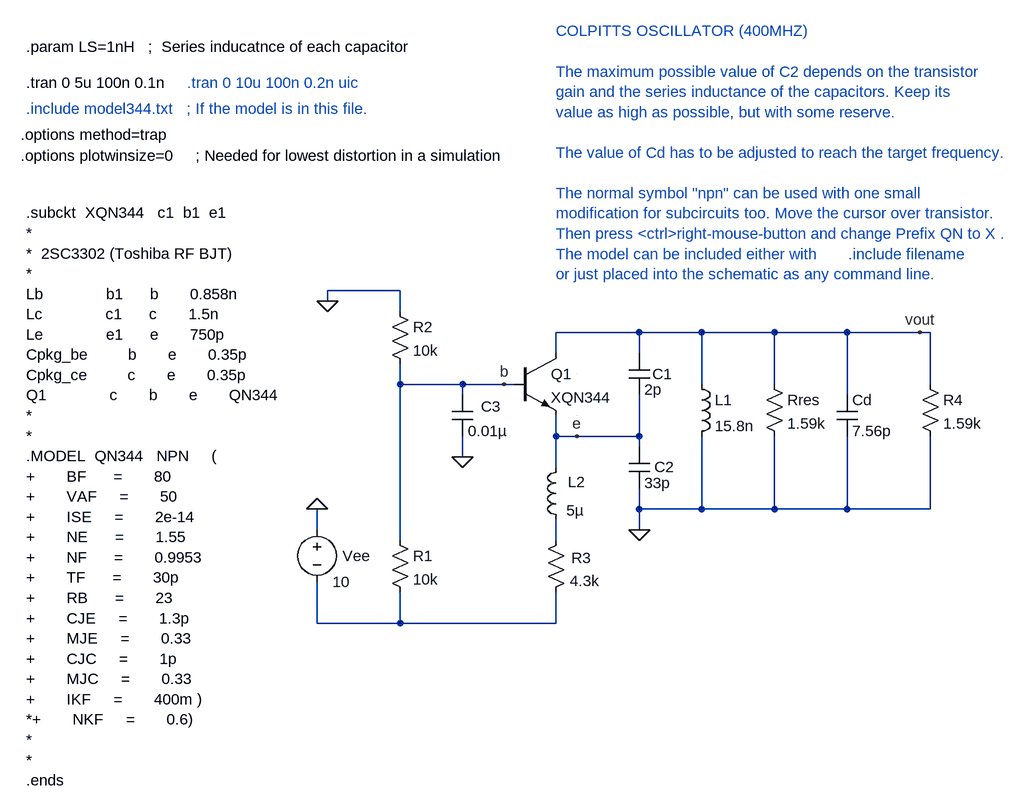
[diagram p0: schematic colpitts_oscillator_400MHz.asc]
colpitts_oscillator_400MHz.asc, the LTspice schematic file:
Version 4
SHEET 1 1024 704
WIRE -448 16 -336 16
WIRE -240 240 -240 272
WIRE -336 160 -240 160
WIRE -96 240 -96 288
WIRE -336 480 -336 528
WIRE 32 80 32 112
WIRE 32 80 128 80
WIRE 128 80 128 160
WIRE 128 80 240 80
WIRE 240 80 240 160
WIRE 128 240 128 352
WIRE 32 256 32 240
WIRE 32 320 32 352
WIRE 32 352 128 352
WIRE 128 352 240 352
WIRE 240 352 240 240
WIRE 32 352 32 384
WIRE 240 80 352 80
WIRE 352 80 352 176
WIRE 352 240 352 352
WIRE 352 352 240 352
WIRE 352 80 464 80
WIRE 480 80 480 160
WIRE 480 240 480 352
WIRE 480 352 352 352
WIRE 464 80 480 80
WIRE -336 528 -96 528
WIRE -96 528 -96 480
WIRE -96 400 -96 368
WIRE -96 208 -96 240
WIRE -448 16 -448 32
WIRE -336 128 -336 160
WIRE -336 160 -336 400
WIRE -336 48 -336 16
WIRE -464 464 -464 528
WIRE -464 528 -336 528
WIRE -464 352 -464 384
WIRE -240 160 -240 176
WIRE -96 112 -96 80
WIRE -96 80 32 80
WIRE -96 240 -64 240
WIRE 32 240 32 176
WIRE -64 240 32 240
WIRE -160 160 -176 160
WIRE -240 160 -176 160
FLAG -176 160 b
FLAG -448 32 0
FLAG -64 240 e
FLAG 32 384 0
FLAG -464 352 0
FLAG 464 80 vout
FLAG -240 272 0
SYMBOL voltage -464 368 R0
WINDOW 123 0 0 Left 0
WINDOW 39 0 0 Left 0
WINDOW 0 39 56 Left 0
SYMATTR InstName Vee
SYMATTR Value 10
SYMBOL res -352 384 R0
SYMATTR InstName R1
SYMATTR Value 10k
SYMBOL res -352 32 R0
SYMATTR InstName R2
SYMATTR Value 10k
SYMBOL cap -256 176 R0
WINDOW 0 44 18 Left 0
SYMATTR InstName C3
SYMATTR Value 0.01µ
SYMATTR SpiceLine Lser={LS}
SYMBOL ind -80 272 M0
WINDOW 3 -27 82 Left 0
WINDOW 0 -29 38 Left 0
SYMATTR Value 5µ
SYMATTR InstName L2
SYMBOL res -80 384 M0
WINDOW 0 -38 43 Left 0
WINDOW 3 -51 79 Left 0
SYMATTR InstName R3
SYMATTR Value 4.3k
SYMBOL cap 16 112 R0
WINDOW 0 36 32 Left 0
WINDOW 123 24 92 Left 0
SYMATTR InstName C1
SYMATTR Value 2p
SYMATTR SpiceLine Lser={LS}
SYMBOL cap 16 256 R0
WINDOW 0 39 31 Left 0
SYMATTR InstName C2
SYMATTR Value 33p
SYMATTR SpiceLine Lser={LS}
SYMBOL ind 112 144 R0
SYMATTR InstName L1
SYMATTR Value 15.8n
SYMBOL res 224 144 R0
SYMATTR InstName Rres
SYMATTR Value 1.59k
SYMBOL cap 336 176 R0
SYMATTR InstName Cd
SYMATTR Value 7.56p
SYMATTR SpiceLine Lser={LS}
SYMBOL res 464 144 R0
SYMATTR InstName R4
SYMATTR Value 1.59k
SYMBOL npn -160 112 R0
SYMATTR InstName Q1
SYMATTR Value XQN344
SYMATTR Prefix X
TEXT -912 -264 Left 0 ;.include model344.txt   ; If the model is in this file.
TEXT -912 -304 Left 0 !.tran 0 5u 100n 0.1n
TEXT -920 -224 Left 0 !.options method=trap
TEXT -912 -104 Left 0 !.subckt  XQN344   c1  b1  e1\n*\n*  2SC3302 (Toshiba RF BJT)\n*\nLb              b1      b       0.858n   \nLc              c1      c       1.5n\nLe              e1      e       750p\nCpkg_be         b       e       0.35p   \nCpkg_ce         c       e       0.35p\nQ1              c       b       e       QN344\n*   \n*\n.MODEL  QN344   NPN     (\n+       BF      =       80          \n+       VAF     =       50\n+       ISE     =       2e-14    \n+       NE      =       1.55    \n+       NF      =       0.9953    \n+       TF      =       30p\n+       RB      =       23              \n+       CJE     =       1.3p\n+       MJE     =       0.33\n+       CJC     =       1p\n+       MJC     =       0.33\n+       IKF     =       400m )    \n*+       NKF     =       0.6)\n*\n*\n.ends
TEXT -664 -304 Left 0 ;.tran 0 10u 100n 0.2n uic
TEXT -912 -360 Left 0 !.param LS=1nH   ;  Series inducatnce of each capacitor
TEXT -96 -384 Left 0 ;COLPITTS OSCILLATOR (400MHZ)\n \nThe maximum possible value of C2 depends on the transistor\ngain and the series inductance of the capacitors. Keep its \nvalue as high as possible, but with some reserve.\n \nThe value of Cd has to be adjusted to reach the target frequency.\n \nThe normal symbol "npn" can be used with one small \nmodification for subcircuits too. Move the cursor over transistor.\nThen press <ctrl>right-mouse-button and change Prefix QN to X .\nThe model can be included either with       .include filename\nor just placed into the schematic as any command line.
TEXT -920 -192 Left 0 !.options plotwinsize=0     ; Needed for lowest distortion in a simulation
LINE Normal -64 208 -64 208
LINE Normal -64 208 -64 208
LINE Normal -64 208 -64 208
LINE Normal -64 208 -64 208
LINE Normal -64 144 -64 144

The netlist it stands for:
* colpitts_oscillator_400MHz.asc
Vee 0 N001 10
R1 b N001 10k
R2 0 b 10k
C3 b 0 0.01µ Lser={LS}
L2 e N002 5µ
R3 N002 N001 4.3k
C1 vout e 2p Lser={LS}
C2 e 0 33p Lser={LS}
L1 vout 0 15.8n
Rres vout 0 1.59k
Cd vout 0 7.56p Lser={LS}
R4 vout 0 1.59k
XQ1 vout b e XQN344  ; pins C B E
* .include model344.txt   ; If the model is in this file.
.tran 0 5u 100n 0.1n
.options method=trap
.subckt  XQN344   c1  b1  e1
*
*  2SC3302 (Toshiba RF BJT)
*
Lb              b1      b       0.858n
Lc              c1      c       1.5n
Le              e1      e       750p
Cpkg_be         b       e       0.35p
Cpkg_ce         c       e       0.35p
Q1              c       b       e       QN344
*
*
.MODEL  QN344   NPN     (
+       BF      =       80
+       VAF     =       50
+       ISE     =       2e-14
+       NE      =       1.55
+       NF      =       0.9953
+       TF      =       30p
+       RB      =       23
+       CJE     =       1.3p
+       MJE     =       0.33
+       CJC     =       1p
+       MJC     =       0.33
+       IKF     =       400m )
*+       NKF     =       0.6)
*
*
.ends
* .tran 0 10u 100n 0.2n uic
.param LS=1nH   ;  Series inducatnce of each capacitor
* COLPITTS OSCILLATOR (400MHZ)
* The maximum possible value of C2 depends on the transistor
* gain and the series inductance of the capacitors. Keep its
* value as high as possible, but with some reserve.
* The value of Cd has to be adjusted to reach the target frequency.
* The normal symbol "npn" can be used with one small
* modification for subcircuits too. Move the cursor over transistor.
* Then press <ctrl>right-mouse-button and change Prefix QN to X .
* The model can be included either with       .include filename
* or just placed into the schematic as any command line.
.options plotwinsize=0     ; Needed for lowest distortion in a simulation
.backanno
.end